# EAGLE design Beagle Cape (EAGLE 6.4)
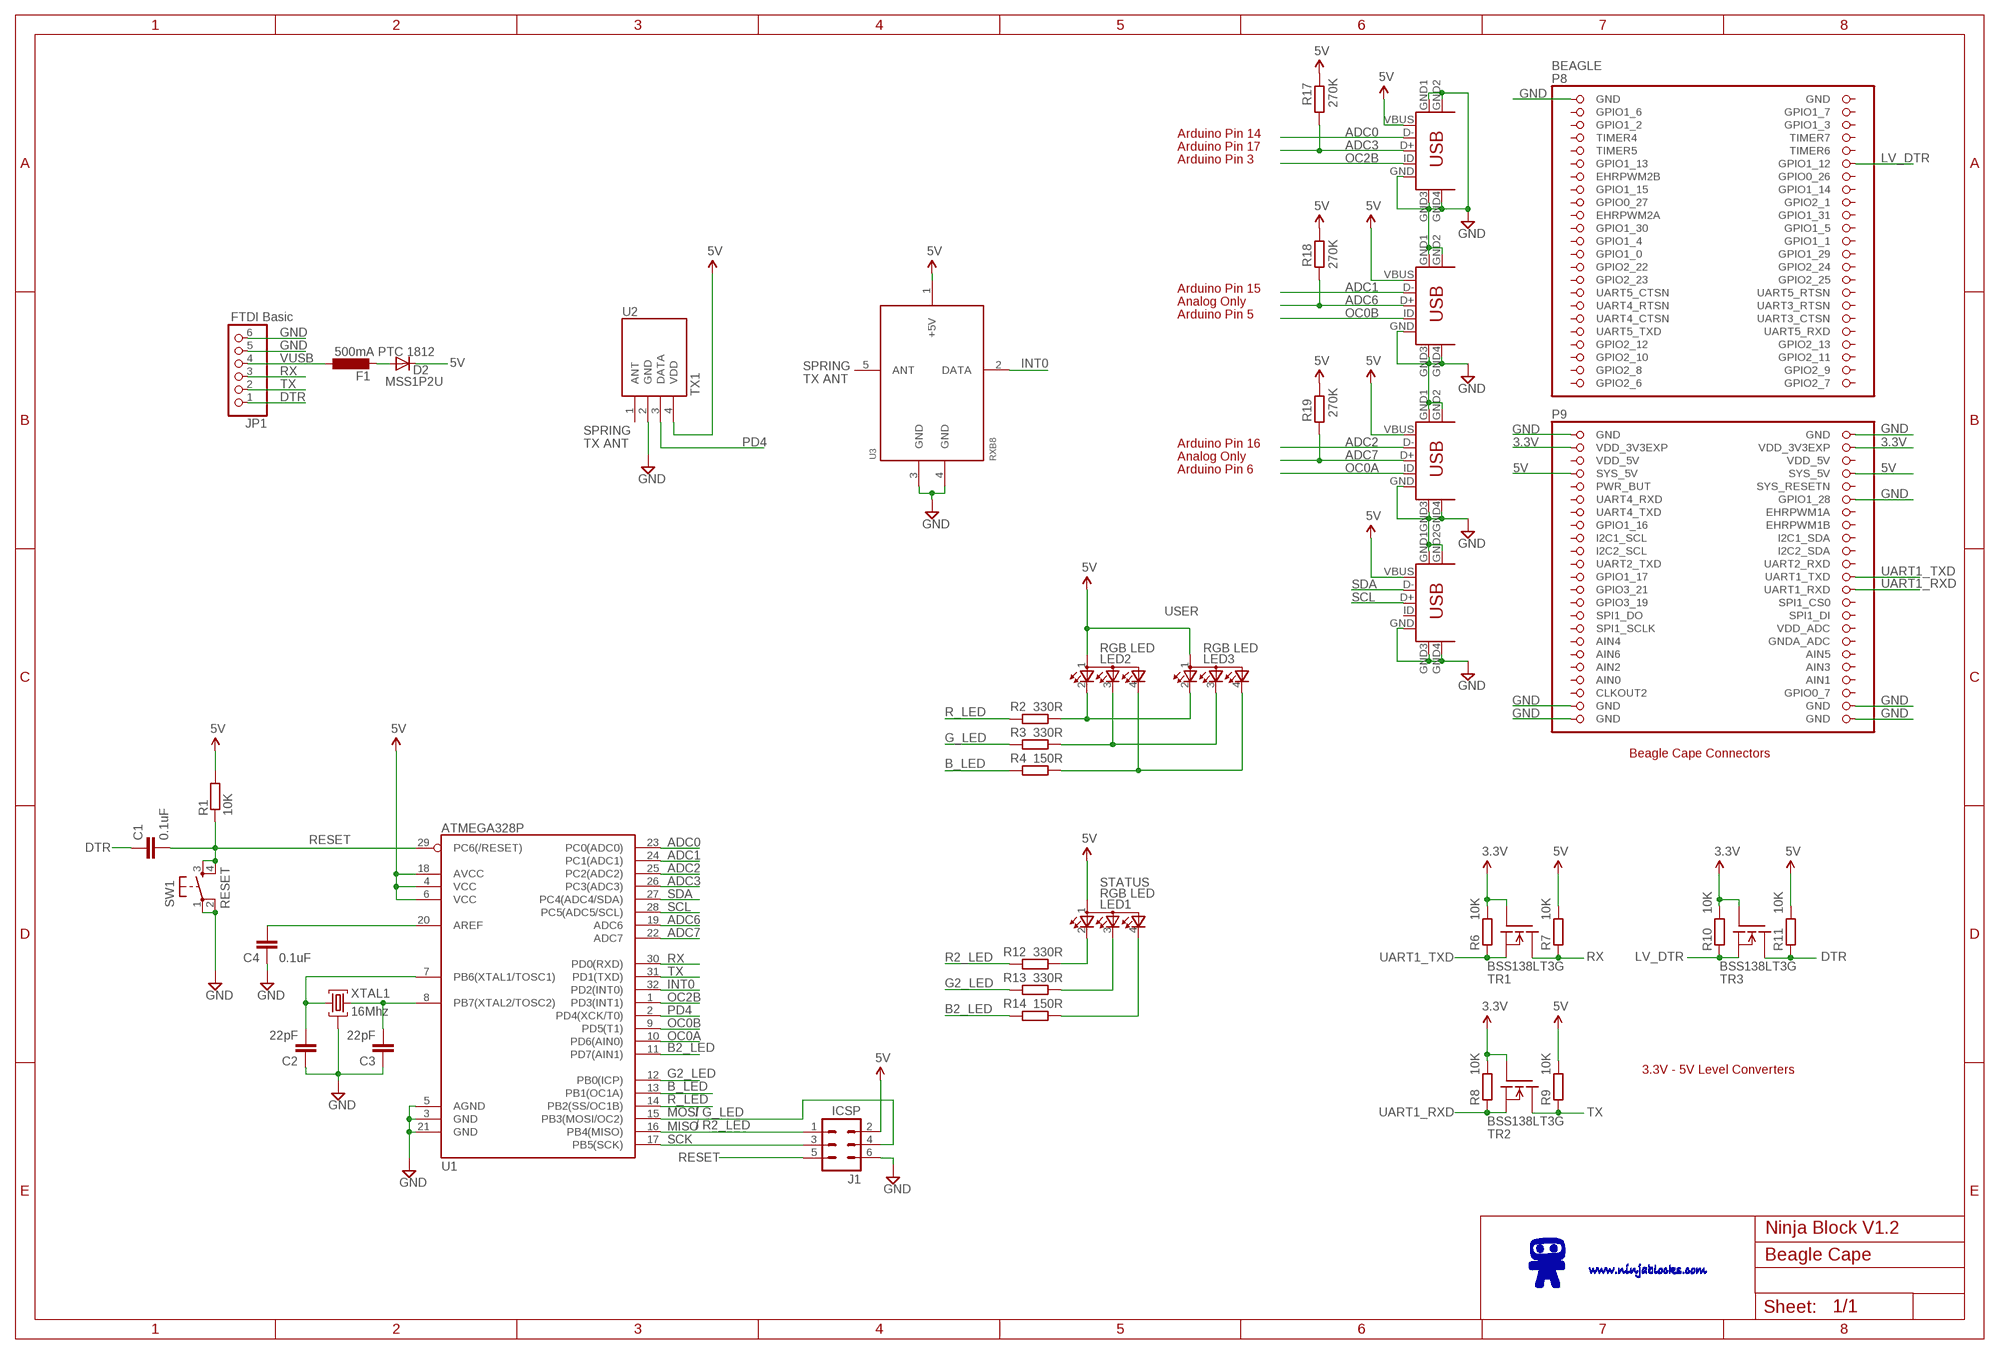
[diagram p0: schematic, sheet 1]

## Parts
BEAGLE  BEAGLEBONE_OUTLINE  [BEAGLEBONE_SHIELD]
C1  0.1uF  C-EUC0603  [C0603]
C2  22pF  C-EUC0603  [C0603]
C3  22pF  C-EUC0603  [C0603]
C4  0.1uF  C-EUC0603  [C0603]
CON1  USB-MINIB  [MOLEX_MINIUSB_B]
CON2  USB-MINIB  [MOLEX_MINIUSB_B]
CON3  USB-MINIB  [MOLEX_MINIUSB_B]
D2  MSS1P2U  [MICROSMP]
F1  500mA PTC 1812  L-EUL1812  [L1812]
I2C  USB-MINIB  [MOLEX_MINIUSB_B]
J1  ICSP  MA03-2  [MA03-2]
JP1  FTDI Basic  PINHD-1X6  [1X06]
LED1  RGB LED  AVAGO_RGB_LED  [AVAGO_LED]
LED2  RGB LED  AVAGO_RGB_LED  [AVAGO_LED]
LED3  RGB LED  AVAGO_RGB_LED  [AVAGO_LED]
R1  10K  R-EU_R0603  [R0603]
R2  330R  R-EU_R0603  [R0603]
R3  330R  R-EU_R0603  [R0603]
R4  150R  R-EU_R0603  [R0603]
R6  10K  R-EU_R0603  [R0603]
R7  10K  R-EU_R0603  [R0603]
R8  10K  R-EU_R0603  [R0603]
R9  10K  R-EU_R0603  [R0603]
R10  10K  R-EU_R0603  [R0603]
R11  10K  R-EU_R0603  [R0603]
R12  330R  R-EU_R0603  [R0603]
R13  330R  R-EU_R0603  [R0603]
R14  150R  R-EU_R0603  [R0603]
R17  270K  R-EU_R0603  [R0603]
R18  270K  R-EU_R0603  [R0603]
R19  270K  R-EU_R0603  [R0603]
SW1  RESET  ALPS_SMD_TAC_SWITCH  [ALPS_SMD_TAC_SWITCH]
TR1  BSS138LT3G  IRLML2502PBF  [SOT23]
TR2  BSS138LT3G  IRLML2502PBF  [SOT23]
TR3  BSS138LT3G  IRLML2502PBF  [SOT23]
U1  ATMEGA328P  ATMEGA168  [TQFP32-08]
U2  TX1  [TX1]
U3  RXB8  [RXB8]
XTAL1  16Mhz  12MHZ  [HC49US-G]

## Nets
3.3V: BEAGLE.49(VDD_3V3EXP) BEAGLE.50(VDD_3V3EXP) R6.1 R8.1 R10.1 TR1.1(G) TR2.1(G) TR3.1(G)
5V: BEAGLE.53(SYS_5V) BEAGLE.54(SYS_5V) CON1.VBUS CON2.VBUS CON3.VBUS D2.C I2C.VBUS J1.2 LED1.1(A1) LED2.1(A1) LED3.1(A1) R1.2 R7.1 R9.1 R11.1 R17.1 R18.1 R19.1 U1.4(VCC) U1.6(VCC) U1.18(AVCC) U2.4(VDD) U3.1(+5V)
ADC0: CON1.D- U1.23(PC0(ADC0))
ADC1: CON2.D- U1.24(PC1(ADC1))
ADC2: CON3.D- U1.25(PC2(ADC2))
ADC3: CON1.D+ R17.2 U1.26(PC3(ADC3))
ADC6: CON2.D+ R18.2 U1.19(ADC6)
ADC7: CON3.D+ R19.2 U1.22(ADC7)
B2_LED: R14.2 U1.11(PD7(AIN1))
B_LED: R4.2 U1.13(PB1(OC1A))
DTR: C1.1 JP1.1 R11.2 TR3.3(D)
G2_LED: R13.2 U1.12(PB0(ICP))
GND: BEAGLE.1(GND) BEAGLE.47(GND) BEAGLE.48(GND) BEAGLE.58(GPIO1_28) BEAGLE.89(GND) BEAGLE.90(GND) BEAGLE.91(GND) BEAGLE.92(GND) C2.1 C3.1 C4.1 CON1.GND CON1.GND1(MTN1) CON1.GND2(MTN2) CON1.GND3(MTN3) CON1.GND4(MTN4) CON2.GND CON2.GND1(MTN1) CON2.GND2(MTN2) CON2.GND3(MTN3) CON2.GND4(MTN4) CON3.GND CON3.GND1(MTN1) CON3.GND2(MTN2) CON3.GND3(MTN3) CON3.GND4(MTN4) I2C.GND I2C.GND1(MTN1) I2C.GND2(MTN2) I2C.GND3(MTN3) I2C.GND4(MTN4) J1.6 JP1.5 JP1.6 SW1.1 SW1.2 U1.3(GND) U1.5(AGND) U1.21(GND) U2.2(GND) U3.3(GND) U3.4(GND) XTAL1.GND
INT0: U1.32(PD2(INT0)) U3.2(DATA)
LV_DTR: BEAGLE.12(GPIO1_12) R10.2 TR3.2(S)
MISO: J1.1 R12.2 U1.16(PB4(MISO))
MOSI: J1.4 R3.2 U1.15(PB3(MOSI/OC2))
N$1: C2.2 U1.7(PB6(XTAL1/TOSC1)) XTAL1.1
N$2: LED2.2(R2) LED3.2(R2) R2.1
N$3: C3.2 U1.8(PB7(XTAL2/TOSC2)) XTAL1.2
N$4: C4.2 U1.20(AREF)
N$5: LED2.3(G3) LED3.3(G3) R3.1
N$6: LED2.4(B4) LED3.4(B4) R4.1
N$9: LED1.2(R2) R12.1
N$10: LED1.3(G3) R13.1
N$11: LED1.4(B4) R14.1
N$16: D2.A F1.2
OC0A: CON3.ID U1.10(PD6(AIN0))
OC0B: CON2.ID U1.9(PD5(T1))
OC2B: CON1.ID U1.1(PD3(INT1))
PD4: U1.2(PD4(XCK/T0)) U2.3(DATA)
R_LED: R2.2 U1.14(PB2(SS/OC1B))
RESET: C1.2 J1.5 R1.1 SW1.3 SW1.4 U1.29(PC6(/RESET))
RX: JP1.3 R7.2 TR1.3(D) U1.30(PD0(RXD))
SCK: J1.3 U1.17(PB5(SCK))
SCL: I2C.D+ U1.28(PC5(ADC5/SCL))
SDA: I2C.D- U1.27(PC4(ADC4/SDA))
TX: JP1.2 R9.2 TR2.3(D) U1.31(PD1(TXD))
UART1_RXD: BEAGLE.72(UART1_RXD) R8.2 TR2.2(S)
UART1_TXD: BEAGLE.70(UART1_TXD) R6.2 TR1.2(S)
VUSB: F1.1 JP1.4
Unconnected: BEAGLE.5(GPIO1_2) BEAGLE.6(GPIO1_3) BEAGLE.7(TIMER4) BEAGLE.8(TIMER7) BEAGLE.9(TIMER5) BEAGLE.10(TIMER6) BEAGLE.11(GPIO1_13) BEAGLE.13(EHRPWM2B) BEAGLE.14(GPIO0_26) BEAGLE.15(GPIO1_15) BEAGLE.16(GPIO1_14) BEAGLE.17(GPIO0_27) BEAGLE.18(GPIO2_1) BEAGLE.19(EHRPWM2A) BEAGLE.20(GPIO1_31) BEAGLE.21(GPIO1_30) BEAGLE.22(GPIO1_5) BEAGLE.23(GPIO1_4) BEAGLE.24(GPIO1_1) BEAGLE.25(GPIO1_0) BEAGLE.26(GPIO1_29) BEAGLE.27(GPIO2_22) BEAGLE.28(GPIO2_24) BEAGLE.29(GPIO2_23) BEAGLE.30(GPIO2_25) BEAGLE.31(UART5_CTSN) BEAGLE.32(UART5_RTSN) BEAGLE.33(UART4_RTSN) BEAGLE.34(UART3_RTSN) BEAGLE.35(UART4_CTSN) BEAGLE.36(UART3_CTSN) BEAGLE.37(UART5_TXD) BEAGLE.38(UART5_RXD) BEAGLE.39(GPIO2_12) BEAGLE.40(GPIO2_13) BEAGLE.41(GPIO2_10) BEAGLE.55(PWR_BUT) BEAGLE.56(SYS_RESETN) BEAGLE.57(UART4_RXD) BEAGLE.59(UART4_TXD) BEAGLE.60(EHRPWM1A) BEAGLE.61(GPIO1_16) BEAGLE.62(EHRPWM1B) BEAGLE.63(I2C1_SCL) BEAGLE.64(I2C1_SDA) BEAGLE.65(I2C2_SCL) BEAGLE.66(I2C2_SDA) BEAGLE.67(UART2_TXD) BEAGLE.68(UART2_RXD) BEAGLE.69(GPIO1_17) BEAGLE.71(GPIO3_21) BEAGLE.73(GPIO3_19) BEAGLE.74(SPI1_CS0) BEAGLE.75(SPI1_DO) BEAGLE.76(SPI1_DI) BEAGLE.77(SPI1_SCLK) BEAGLE.78(VDD_ADC) BEAGLE.79(AIN4) BEAGLE.80(GNDA_ADC) BEAGLE.81(AIN6) BEAGLE.82(AIN5) BEAGLE.83(AIN2) BEAGLE.86(AIN1) BEAGLE.87(CLKOUT2) BEAGLE.88(GPIO0_7) I2C.ID U2.1(ANT) U3.5(ANT)

## Notes on the sheet
- Arduino Pin 14
- Arduino Pin 17
- Arduino Pin 3
- Arduino Pin 15
- Analog Only
- Arduino Pin 5
- SPRING
- TX ANT
- SPRING
- TX ANT | Arduino Pin 16
- Analog Only
- Arduino Pin 6
- USER
- G_LED
- Beagle Cape Connectors
- STATUS
- R2_LED
- 3.3V - 5V Level Converters
- / G_LED
- / R2_LED
- Ninja Block V1.2

## Power pins joined to a net without a drawn wire
AIN0: BEAGLE.85(AIN0)
AIN3: BEAGLE.84(AIN3)
GND: BEAGLE.2(GND)
GPIO1_6: BEAGLE.3(GPIO1_6)
GPIO1_7: BEAGLE.4(GPIO1_7)
GPIO2_6: BEAGLE.45(GPIO2_6)
GPIO2_7: BEAGLE.46(GPIO2_7)
GPIO2_8: BEAGLE.43(GPIO2_8)
GPIO2_9: BEAGLE.44(GPIO2_9)
GPIO2_11: BEAGLE.42(GPIO2_11)
VDD_5V: BEAGLE.51(VDD_5V) BEAGLE.52(VDD_5V)

## Library data of the parts
BEAGLE = adafruit:BEAGLEBONE_OUTLINE: Should match A3 pinout - but not completely tested
C1-C4 = rcl:C-EU: CAPACITOR, European symbol
CON1-CON3 I2C = SparkFun:USB-MINIB: Mini-USB "B" connector with 5th pin broken out. Created new symbol breaking out 5th "ID" pin in mini/micro USB connector spec. See: http://en.wikipedia.org/wiki/Mini_usb#Cables. Uses same footprint as 4-pin symbol. Also added pins to connect to mounting / shield pads if required (probably not generally needed as signals aren't shielded once they leave the connector).
D2 = Monkey:MSS1P2U: MSS1P2U-M3/89A Schottky Rectifier Datasheet : http://www.vishay.com/docs/89020/mss1p3l.pdf
F1 = rcl:L-EU: INDUCTOR, European symbol
J1 = con-lstb:MA03-2: PIN HEADER; OC_FARNELL: unknown; OC_NEWARK: unknown
JP1 = pinhead:PINHD-1X6: PIN HEADER
LED1-LED3 = Monkey:AVAGO_RGB_LED
R1-R4 R6-R14 R17-R19 = resistor:R-EU_: RESISTOR, European symbol
SW1 = Monkey:ALPS_SMD_TAC_SWITCH: ALPS SMD Tactile Switch SKQGAKE010 Source : http://www.farnell.com/datasheets/78970.pdf
TR1-TR3 = Monkey:IRLML2502PBF: IRLML2502 N-Channel HexFet Power Mosfet Datasheet : http://www.irf.com/product-info/datasheets/data/irlml2502pbf.pdf
U1 = SparkFun:ATMEGA168
U2 = ninja:TX1
U3 = ninja:RXB8: RY-RXB8 ASK Receiving module http://www.relyrf.com/rf/ask_receiver/RY-RXB8.htm
XTAL1 = Monkey:12MHZ: HC/49US (AT49) 3RD LEAD CASE-GROUNDED SMD LOW PROFILE CRYSTAL CRYSTAL, 12MHz, 18pF, HC-49/US Source : http://www.abracon.com/Resonators/ABLSG.pdf

## Board
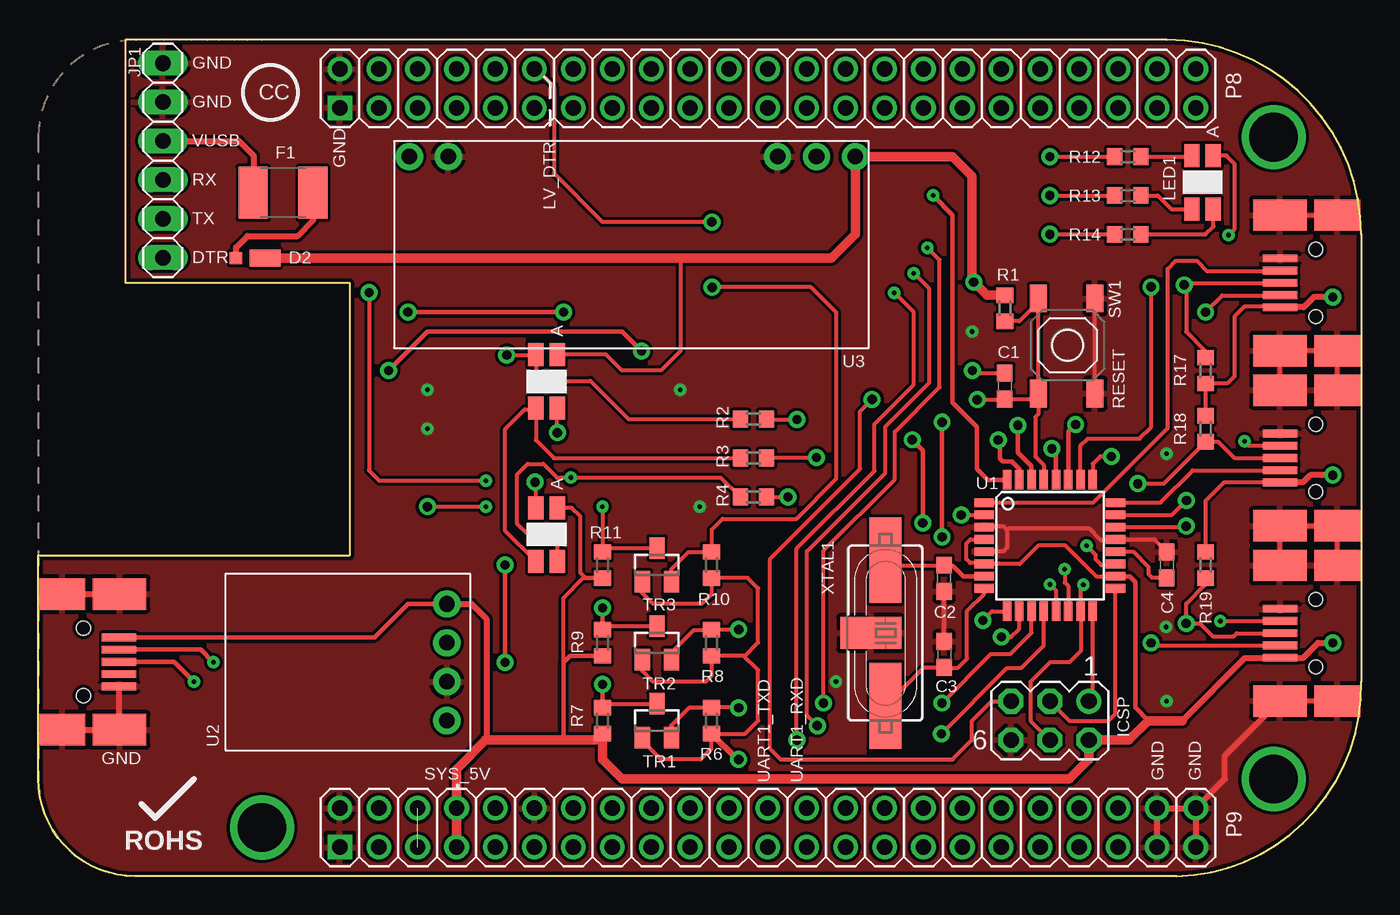
[diagram p1: board, top side]
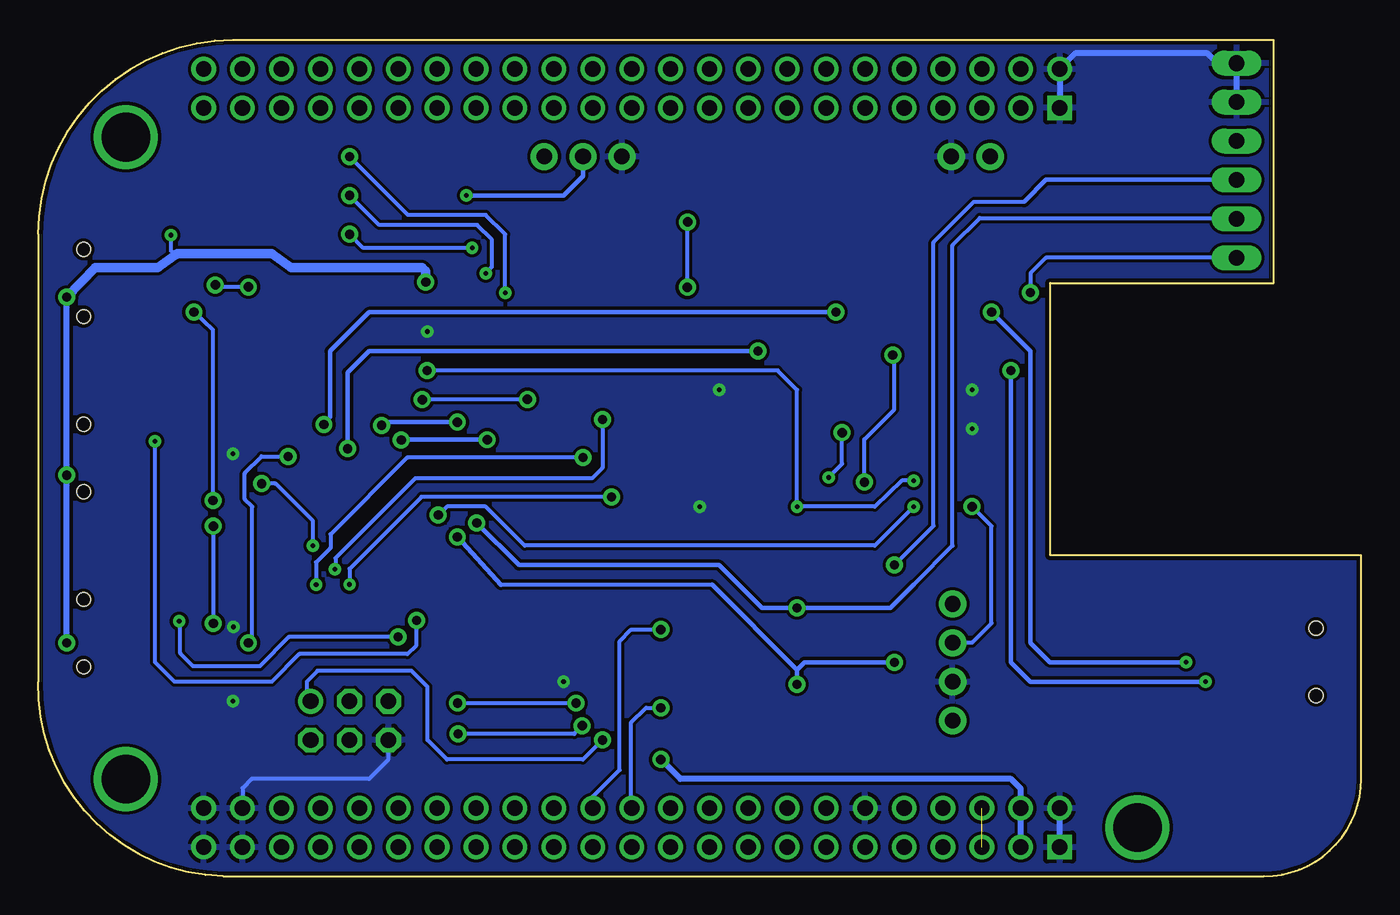
[diagram p2: board, bottom side, seen from below]

Size 86.36 x 54.61 mm. Coordinates in mm from the lower left corner, seen from the top.
Copper layers (1*16): Top 0.035mm / dielectric 1.5mm / Bottom 0.035mm
Design rules "SparkFun": minimum track width 8mil, minimum drill 20mil, track to track 8mil, track to pad 8mil, pad to pad 8mil, via to via 8mil, smd to smd 8mil, copper to edge 10mil, drill to drill 8mil, minimum pad ring 12mil, minimum via ring 10mil, stop-mask expansion 4mil, vias tented up to drill 25mil, thermal gap 10mil

### Footprints (pad centres in the part's own frame; a part is rotated, then mirrored left to right if it is on the bottom)
BEAGLEBONE_SHIELD = drill 1 square: 1 19.685,50.165; 47 19.685,1.905 | drill 1: 2 19.685,52.705; 3 22.225,50.165; 4 22.225,52.705; 5 24.765,50.165; 6 24.765,52.705; 7 27.305,50.165; 8 27.305,52.705; 9 29.845,50.165; 10 29.845,52.705; 11 32.385,50.165; 12 32.385,52.705; 13 34.925,50.165; 14 34.925,52.705; 15 37.465,50.165; 16 37.465,52.705; 17 40.005,50.165; 18 40.005,52.705; 19 42.545,50.165; 20 42.545,52.705; 21 45.085,50.165; 22 45.085,52.705; 23 47.625,50.165; 24 47.625,52.705; 25 50.165,50.165; 26 50.165,52.705; 27 52.705,50.165; 28 52.705,52.705; 29 55.245,50.165; 30 55.245,52.705; 31 57.785,50.165; 32 57.785,52.705; 33 60.325,50.165; 34 60.325,52.705; 35 62.865,50.165; 36 62.865,52.705; 37 65.405,50.165; 38 65.405,52.705; 39 67.945,50.165; 40 67.945,52.705; 41 70.485,50.165; 42 70.485,52.705; 43 73.025,50.165; 44 73.025,52.705; 45 75.565,50.165; 46 75.565,52.705; 48 19.685,4.445; 49 22.225,1.905; 50 22.225,4.445; 51 24.765,1.905; 52 24.765,4.445; 53 27.305,1.905; 54 27.305,4.445; 55 29.845,1.905; 56 29.845,4.445; 57 32.385,1.905; 58 32.385,4.445; 59 34.925,1.905; 60 34.925,4.445; 61 37.465,1.905; 62 37.465,4.445; 63 40.005,1.905; 64 40.005,4.445; 65 42.545,1.905; 66 42.545,4.445; 67 45.085,1.905; 68 45.085,4.445; 69 47.625,1.905; 70 47.625,4.445; 71 50.165,1.905; 72 50.165,4.445; 73 52.705,1.905; 74 52.705,4.445; 75 55.245,1.905; 76 55.245,4.445; 77 57.785,1.905; 78 57.785,4.445; 79 60.325,1.905; 80 60.325,4.445; 81 62.865,1.905; 82 62.865,4.445; 83 65.405,1.905; 84 65.405,4.445; 85 67.945,1.905; 86 67.945,4.445; 87 70.485,1.905; 88 70.485,4.445; 89 73.025,1.905; 90 73.025,4.445; 91 75.565,1.905; 92 75.565,4.445 | drill 3.175: P$1 14.605,3.175; P$2 80.645,6.35; P$3 80.645,48.26
C0603 = smd 1.1 x 1: 1 -0.85,0; 2 0.85,0
MOLEX_MINIUSB_B = smd 2.25 x 0.5: D+ 2.325,-0.005; D- 2.325,0.795; GND 2.325,-1.605; ID 2.325,-0.805; VBUS 2.325,1.595 | smd 3 x 2.05: GND1 -1.4,-4.43; GND3 -1.4,4.42 | smd 3.5 x 2.05: GND2 2.35,-4.43; GND4 2.35,4.42 | hole 0.9: 0,-2.205; 0,2.195
MICROSMP = smd 0.8 x 0.8: A 1.9,0 | smd 2 x 1.1: C 0,0
L1812 = smd 1.9 x 3.4: 1 -1.95,0; 2 1.95,0
MA03-2 = drill 1.016: 1 -2.54,-1.27 | drill 1.016 octagon: 2 -2.54,1.27; 3 0,-1.27; 4 0,1.27; 5 2.54,-1.27; 6 2.54,1.27
1X06 = drill 1.016 long: 1 -6.35,0; 2 -3.81,0; 3 -1.27,0; 4 1.27,0; 5 3.81,0; 6 6.35,0
AVAGO_LED = smd 1.5 x 1: 1 1.75,-0.7; 2 1.75,0.7; 3 -1.75,0.7; 4 -1.75,-0.7
R0603 = smd 1 x 1.1: 1 -0.85,0; 2 0.85,0
ALPS_SMD_TAC_SWITCH = smd 1.8 x 1.1: 1 0,3.7; 2 6.2,3.7; 3 0,0; 4 6.2,0
SOT23 = smd 1 x 1.4: 1 -0.95,-1.1; 2 0.95,-1.1; 3 0,1.1
TQFP32-08 = smd 1.27 x 0.559: 1 -4.293,2.8; 2 -4.293,2; 3 -4.293,1.2; 4 -4.293,0.4; 5 -4.293,-0.4; 6 -4.293,-1.2; 7 -4.293,-2; 8 -4.293,-2.8; 17 4.293,-2.8; 18 4.293,-2; 19 4.293,-1.2; 20 4.293,-0.4; 21 4.293,0.4; 22 4.293,1.2; 23 4.293,2; 24 4.293,2.8 | smd 0.559 x 1.27: 9 -2.8,-4.293; 10 -2,-4.293; 11 -1.2,-4.293; 12 -0.4,-4.293; 13 0.4,-4.293; 14 1.2,-4.293; 15 2,-4.293; 16 2.8,-4.293; 25 2.8,4.293; 26 2,4.293; 27 1.2,4.293; 28 0.4,4.293; 29 -0.4,4.293; 30 -1.2,4.293; 31 -2,4.293; 32 -2.8,4.293
TX1 = drill 1.016 pad 1.778: 1 0,0; 2 2.54,0; 3 5.08,0; 4 7.62,0
RXB8 = drill 1.016 pad 1.778: 1 -24.13,0; 2 -21.59,0; 3 -19.05,0; 4 2.45,0; 5 4.99,0
HC49US-G = smd 5.6 x 2.1: 1 -11.74,0.95; 2 -2.24,0.95 | smd 2.1 x 4: GND -6.99,0

### Placement (x,y rotation side)
BEAGLE  0,0 0 top
C1  63.09,32 270 top
C2  59.13,19.46 90 top
C3  59.13,14.48 270 top
C4  73.66,20.32 270 top
CON1  83.4,38.73 180 top
CON2  83.4,27.3 180 top
CON3  83.4,15.87 180 top
D2  14.81,40.36 180 top
F1  15.98,44.63 0 top
I2C  2.95,14 0 top
J1  66.04,10.16 180 top
JP1  8.13,46.74 90 top
LED1  76,45.3 90 top
LED2  33.18,32.3 90 top
LED3  33.18,22.3 90 top
R1  63.09,37.08 90 top
R2  46.69,29.84 0 top
R3  46.69,27.3 0 top
R4  46.69,24.77 0 top
R6  43.94,10.16 90 top
R7  36.83,10.16 90 top
R8  43.94,15.24 90 top
R9  36.83,15.24 90 top
R10  43.94,20.32 90 top
R11  36.83,20.32 90 top
R12  71.12,46.99 180 top
R13  71.12,44.45 180 top
R14  71.12,41.91 180 top
R17  76.2,33.02 90 top
R18  76.2,29.21 270 top
R19  76.2,20.32 270 top
SW1  65.28,37.72 270 top
TR1  40.39,10.16 0 top
TR2  40.39,15.24 0 top
TR3  40.39,20.32 0 top
U1  66.04,21.59 0 top
U2  26.67,10.16 90 top
U3  29.21,46.99 180 top
XTAL1  54.36,8.89 270 top

### Tracks (layer width: path | path; a pad name or v marks a point on that pad's centre or on a via)
3.3V  (via drill 0.6)
  Top 0.254: TR3.1 39.44,19.12 39.37,19.05 39.37,18.54 40.13,17.78 43.31,17.78 43.94,18.41 R10.1 43.95,19.48 46.3,19.48 46.99,18.8 46.99,15.27 46.13,14.4 46.05,14.4 | TR2.1 39.44,13.4 40.13,12.7 43.56,12.7 43.94,13.08 43.94,13.89 44.45,14.4 | TR1.1 39.44,8.82 40.64,7.62 43.23,7.62 43.92,8.31 43.92,9.29 R6.1 46.14,9.31 46.99,10.16 46.99,13.46 46.05,14.4 | 46.05,14.4 44.45,14.4 | 44.45,14.4 43.95,14.4 R8.1
  Top 0.406: v45.72,7.62 45.63,7.62 R6.1
  Bottom 0.406: BEAGLE.49 BEAGLE.50 22.23,5.71 22.86,6.35 44.45,6.35 v45.72,7.62
5V  (via drill 0.3, 0.6)
  Top 0.254: U1.4 60.85,21.99 60.58,21.72 60.58,20.7 60.83,20.45 61.69,20.45 U1.6 64.08,20.39 65.28,21.59 67.06,21.59 69.09,19.56 70.3,19.56 U1.18 | CON1.VBUS | CON1.VBUS | v61.06,38.79 60.96,38.89 | R18.1 R17.1 77.61,32.17 78.08,32.64 78.08,36.52 78.74,37.19 81.03,37.19 CON1.VBUS | CON2.VBUS 77.39,25.7 76.2,24.51 R19.1 | LED3.1 34.82,24.05 35.38,23.5 35.38,19.81 35.72,19.47 R11.1 35.57,19.47 34.29,18.19 34.29,13.97 | LED1.1 77.56,47.05 78.11,46.51 78.11,42.27 v77.7,41.86 | LED2.1 37.06,34.05 38.1,33.02 40.64,33.02 41.91,34.29 41.91,40.36
  Top 0.305: U1.18 71.25,19.58 71.6,19.23 71.6,12.09 71.6,11.02 72.47,10.16 | 34.29,8.89 34.29,13.97 34.71,14.39 R9.1 | I2C.VBUS 21.95,15.6 24.13,17.78 U2.4
  Top 0.406: 81.13,25.7 CON2.VBUS 82.56,25.71 83.04,26.19 83.79,26.19 v84.5,26.19 | CON1.VBUS 81.05,37.13 | v84.5,37.82 83.27,37.82 82.6,37.15 CON1.VBUS | v84.5,15.24 83.55,15.24 82.58,14.27 CON3.VBUS 81.05,14.25 78.77,14.25 74.68,10.16 | 36.41,8.89 R7.1 | U2.4 28.27,17.78 29.26,16.79 29.26,8.94 29.21,8.89
  Top 0.61: BEAGLE.53 BEAGLE.54 27.3,6.99 29.21,8.89 34.29,8.89 36.41,8.89 | R1.2 61.91,37.93 v61.06,38.79 | 74.68,10.16 72.47,10.16 71.2,8.89 J1.2 68.58,7.62 67.31,6.35 38.1,6.35 36.83,7.62 R7.1 | 60.96,38.89 60.96,45.72 59.69,46.99 U3.1 53.34,41.91 51.79,40.36 41.91,40.36 D2.C
  Bottom 0.254: v77.7,41.86 77.7,40.84 77.41,40.56
  Bottom 0.406: v84.5,37.82 v84.5,26.19 v84.5,15.24
  Bottom 0.61: v61.06,38.79 61.06,39.5 61.29,39.73 69.85,39.73 71.12,40.64 77.29,40.64 77.41,40.56 78.56,39.73 82.65,39.73 v84.5,37.82
ADC0  (via drill 0.6)
  Top 0.254: U1.23 74.01,23.59 v74.95,24.54 | CON1.D- 81.06,37.92 77.29,37.92 v76.2,36.83
  Bottom 0.254: v74.95,24.54 74.95,35.66 v76.2,36.83
ADC1
  Top 0.254: U1.24 73.26,24.39 75.36,26.49 81.06,26.49 CON2.D-
ADC2  (via drill 0.6)
  Top 0.254: v70.05,27.41 69.32,27.41 68.83,26.92 U1.25 | CON3.D- 72.81,15.07 v72.64,15.24
  Bottom 0.254: v70.05,27.41 71.78,27.41 72.87,26.31 72.87,24.61 72.39,24.13 72.39,15.49 v72.64,15.24
ADC3  (via drill 0.6)
  Top 0.254: v72.64,38.48 72.64,29.34 71.88,28.57 68.5,28.57 68.04,28.11 U1.26 | CON1.D+ 74.94,38.74 v74.8,38.61 74.93,38.48 74.93,35.56 76.2,34.29 R17.2
  Bottom 0.254: v72.64,38.48 74.68,38.48 v74.8,38.61
ADC6  (via drill 0.3, 0.6)
  Top 0.254: R18.2 76.22,28.34 | R18.2 76.17,28.34 | R18.2 76.19,28.37 | U1.19 69.92,20.39 69.85,20.32 69.39,20.32 69.01,20.7 69.01,21.01 v68.43,21.59 | v71.78,25.63 73.47,25.63 R18.2 | CON2.D+ 78.08,27.31 77.01,28.37 76.21,28.37 R18.2
  Bottom 0.254: v68.43,21.59 68.43,23.19 70.87,25.63 v71.78,25.63
ADC7  (via drill 0.6)
  Top 0.254: CON3.D+ 78.23,15.87 78.03,15.67 76.66,15.67 75.82,16.51 v74.93,16.51 74.93,17.78 76.2,19.05 R19.2 | U1.22 74.86,22.79 v74.93,22.86
  Bottom 0.254: v74.93,22.86 v74.93,16.51
B2_LED  (via drill 0.3, 0.6)
  Top 0.254: U1.11 64.84,15.89 63.45,14.5 62.18,14.5 v58.98,11.3 | v51.26,11.3 51.26,21.26 55.91,25.91 55.91,29.01 58.83,31.93 58.83,40.23 v58.04,41.02 | v66.04,41.91 R14.2
  Bottom 0.254: v51.26,11.3 v58.98,11.3 | v58.04,41.02 65.15,41.02 v66.04,41.91
B_LED  (via drill 0.3, 0.6)
  Top 0.254: U1.13 66.44,18.65 v66.04,19.05 | R4.2 v48.95,24.77
  Bottom 0.254: v48.95,24.77 61.34,24.77 66.04,20.07 v66.04,19.05
DTR  (via drill 0.3, 0.6)
  Top 0.254: TR3.3 37.08,21.42 R11.2 v36.83,24.13 | v21.59,38.1 21.59,26.49 22.25,25.83 v29.21,25.83 | C1.1 61.15,32.85 v60.98,33.02
  Bottom 0.254: JP1.1 20.57,40.39 21.59,39.37 v21.59,38.1 | v29.21,25.83 30,25.83 31.75,24.13 v36.83,24.13 36.83,31.75 38.1,33.02 v60.98,33.02
G2_LED  (via drill 0.3, 0.6)
  Top 0.254: U1.12 65.64,15.07 64.16,13.59 63.25,13.59 v58.95,9.3 | v57.15,39.37 58.17,38.35 58.17,32.23 55.3,29.36 55.3,26.34 50.16,21.21 50.16,10.52 v50.85,9.83 | v66.04,44.45 R13.2
  Bottom 0.254: v57.15,39.37 57.15,39.4 56.74,39.8 56.74,41.55 57.71,42.52 64.11,42.52 v66.04,44.45 | v58.95,9.3 51.38,9.3 v50.85,9.83
GND  (via drill 0.3)
  Top 0.254: SW1.2 SW1.1 | U1.3 62.16,22.79 62.23,22.86 62.99,22.86 63.25,22.61 | 63.25,22.61 63.25,21.46 62.99,21.21 61.77,21.21 U1.5 | 63.25,22.61 63.37,22.73 68.58,22.73 69.34,21.97 70.31,21.97 U1.21 72.84,21.99 C4.1 | CON1.GND2 CON1.GND1
  Top 0.305: CON3.GND2 CON2.GND4 CON2.GND3 CON3.GND1 | CON3.GND4 CON3.GND3 | CON2.GND1 CON1.GND3 CON1.GND4 CON2.GND2 | C3.1 C2.1
  Top 0.406: BEAGLE.89 BEAGLE.90 BEAGLE.92 | BEAGLE.92 BEAGLE.91 | I2C.GND1 I2C.GND2 5.28,9.57 I2C.GND 5.25,12.38 | I2C.GND3 I2C.GND4 | BEAGLE.92 77.47,6.35 77.47,7.87 CON3.GND4
  Bottom 0.254: J1.6 63.5,7.62 64.77,6.35 72.42,6.35 73.03,5.74 BEAGLE.90
  Bottom 0.406: BEAGLE.47 BEAGLE.48 | BEAGLE.1 BEAGLE.2 18.67,53.72 10.03,53.72 9.4,53.09 JP1.6 JP1.5
  other vias: 73.63,16.28 60.96,35.56 73.66,27.58 73.66,11.43 25.4,29.21 25.4,31.75 52.07,12.7 41.91,31.75 43.18,24.13
  pour Top: -5.08,58.42 -5.08,-5.08 88.9,-5.08 88.9,-3.81 88.9,58.42
  pour Bottom: -5.08,58.42 88.9,58.42 88.9,-5.08 -5.08,-5.08 -5.08,-2.54
INT0  (via drill 0.3)
  Top 0.305: U1.32 61.98,25.88 61.27,26.59 61.27,29.34 59.69,30.94 59.69,43.18 v58.42,44.45
  Bottom 0.305: v58.42,44.45 52.07,44.45 50.8,45.72 U3.2
LV_DTR  (via drill 0.6)
  Top 0.254: TR3.2 41.34,20.05 42.44,21.16 43.93,21.16 R10.2 43.97,21.2 43.97,22.63 44.68,23.34 49.48,23.34 52.09,25.96 52.09,36.8 50.44,38.46 v43.99,38.46 | v43.97,42.72 36.83,42.72 33.66,45.9 33.66,51.56 32.51,52.7 BEAGLE.12
  Bottom 0.254: v43.97,42.72 43.97,38.48 v43.99,38.46
MISO  (via drill 0.3, 0.6)
  Top 0.254: U1.16 68.84,11.69 J1.1 | v66.04,46.99 R12.2 | v55.88,38.1 57.15,36.83 57.15,32.11 54.59,29.54 54.59,26.47 49.51,21.39 49.51,8.91 v49.53,8.89
  Bottom 0.254: v66.04,46.99 62.23,43.18 57.15,43.18 55.88,41.91 v55.88,38.1 | v49.53,8.89 50.8,7.62 59.69,7.62 60.96,8.89 60.96,12.37 62,13.41 68.13,13.41 68.84,12.7 68.84,11.69 J1.1
MOSI  (via drill 0.3, 0.6)
  Top 0.254: v50.8,27.33 48.07,27.33 R3.2 | v68.22,19.02 68.04,18.84 U1.15 68.05,14.71 67.31,13.97 66.04,13.97 64.77,12.7 64.77,10.16 J1.4
  Bottom 0.254: v50.8,27.33 62.28,27.33 67.28,22.33 67.28,21.44 68.22,20.5 v68.22,19.02
N$1
  Top 0.254: 55.63,20.31 C2.2
  Top 0.305: 55.63,20.31 XTAL1.1 | U1.7 60.4,19.59 59.72,20.27 59.17,20.27 C2.2
  Top 0.406: 54.77,21.17 XTAL1.1 55.37,20.56 55.37,19.56 55.4,19.59
N$2  (via drill 0.6)
  Top 0.254: LED3.2 32.48,25.69 v32.44,25.73 | v30.58,34.04 32.46,34.04 LED2.2 32.48,32.77 32.92,32.33 36.04,32.33 38.53,29.84 R2.1
  Bottom 0.254: v32.44,25.73 32.44,28.52 30.48,30.48 30.48,33.93 v30.58,34.04
N$3
  Top 0.254: U1.8 61.75,18.44 60.63,17.32 60.63,14.2 60.05,13.61 59.15,13.61 C3.2 57.8,13.63 XTAL1.2
  Top 0.406: 54.76,10.58 XTAL1.2 55.61,11.43
N$4
  Top 0.254: U1.20 71.47,21.19 72.47,20.19 72.47,19.74 72.69,19.51 73.62,19.51 C4.2
N$5
  Top 0.254: R3.1 33.66,27.3 32.48,28.48 LED2.3 32.41,30.48 31.75,30.48 30.48,29.21 30.48,22.55 LED3.3
N$6  (via drill 0.3, 0.6)
  Top 0.254: LED3.4 33.88,21.85 33.45,22.28 32,22.28 31.27,23.01 31.27,26.24 31.95,26.92 32.97,26.92 33.86,26.04 v34.77,26.04 44.54,26.04 R4.1 | LED2.4 v33.88,28.96
  Bottom 0.254: v33.88,28.96 33.88,26.92 v34.77,26.04
N$9
  Top 0.254: R12.1 75.23,46.99 LED1.2
N$10
  Top 0.254: R13.1 73.08,44.45 73.97,43.56 LED1.3
N$11
  Top 0.254: R14.1 76.2,41.91 76.71,42.42 LED1.4
N$16
  Top 0.406: D2.A 12.91,41.05 13.66,41.81 16.92,41.81 17.96,42.85 17.96,44.6 F1.2
OC0A  (via drill 0.3, 0.6)
  Top 0.254: v77.17,16.66 81.07,16.66 CON3.ID | U1.10 64.04,16.16 63.5,15.62 v62.87,15.62
  Bottom 0.254: v77.17,16.66 77.09,16.59 77.09,14.55 76.25,13.72 71.91,13.72 70,15.62 v62.87,15.62
OC0B  (via drill 0.3, 0.6)
  Top 0.254: U1.9 62.26,17.3 v61.67,16.71 | CON2.ID 81.07,28.12 79.02,28.12 v78.74,28.4
  Bottom 0.254: v61.67,16.71 61.67,15.09 62.26,14.5 69.32,14.5 71.12,12.7 77.47,12.7 78.74,13.97 v78.74,28.4
OC2B
  Top 0.254: CON1.ID 81.06,39.52 76.28,39.52 75.62,40.18 74.27,40.18 73.74,39.65 73.74,29.26 68.83,24.38 68.83,24.39 U1.1
PD4  (via drill 0.3, 0.6)
  Top 0.254: U1.2 v60.26,23.59 v60.25,23.6 | v25.4,24.13 v29.21,24.13
  Bottom 0.254: v60.25,23.6 60.22,23.6 59.69,24.13 57.15,24.13 54.61,21.59 31.75,21.59 v29.21,24.13 | v25.4,24.13 24.13,22.86 24.13,16.51 25.4,15.24 U2.3
R_LED  (via drill 0.3, 0.6)
  Top 0.254: v49.53,29.82 48.07,29.82 R2.2 | U1.14 67.24,18.94 67,19.18 v67,20.04
  Bottom 0.254: v49.53,29.82 49.53,26.67 50.22,25.98 61.75,25.98 66.95,20.78 66.95,20.09 v67,20.04
RESET  (via drill 0.6)
  Top 0.254: SW1.4 SW1.3 | 65.27,31.15 SW1.4 | SW1.3 65.66,37.74 | SW1.3 65.28,37.49 64.03,36.25 63.1,36.25 R1.1 | 65.27,31.15 65.64,30.78 | 65.27,31.15 C1.2 63.05,31.11 v61.29,31.11 | U1.29 65.64,26.84 65.08,27.41 65.08,29.97 65.28,30.18 SW1.4 | J1.5 62.23,11.43 60.96,10.16 60.96,8.89 59.69,7.62 48.46,7.62 47.78,8.31 47.78,20.73 53.65,26.59 53.65,30.35 v54.43,31.14
  Bottom 0.254: v54.43,31.14 61.27,31.14 v61.29,31.11
RX  (via drill 0.6)
  Top 0.254: TR1.3 37.08,11.26 R7.2 | U1.30
  Top 0.305: v59,22.15 v59,29.64 | v30.48,13.97 v30.48,20.32 | v36.83,12.52 R7.2 | U1.30 64.84,26.78 63.96,27.66 v63.96,29.44
  Bottom 0.254: 22,44.04 25.27,44.04 27.91,41.4 27.91,22.89 v30.48,20.32
  Bottom 0.305: v59,22.15 56.16,19.02 42.39,19.05 36.83,13.49 | JP1.3 20.57,45.47 22,44.04 | v30.48,13.97 36.35,13.97 36.83,13.49 | 36.83,13.49 v36.83,12.52 | v59,29.64 63.75,29.64 v63.96,29.44
SCK
  Top 0.254: U1.17 70.31,18.77 70.31,10.62 69.85,10.16 67.31,10.16 J1.3
SCL  (via drill 0.3, 0.6)
  Top 0.305: U1.28 66.44,27.54 v66.17,27.91 | I2C.D+ 8.87,13.99 v10.16,12.7 | v22.86,33.02 25.4,35.56 38.1,35.56 v39.37,34.29
  Bottom 0.305: v66.17,27.91 66.17,32.89 64.77,34.29 v39.37,34.29 | v22.86,33.02 22.86,13.97 21.59,12.7 v10.16,12.7
SDA  (via drill 0.3, 0.6)
  Top 0.254: 67.26,25.9 U1.27
  Top 0.305: I2C.D- 10.61,14.79 v11.43,13.97 | v24.13,36.83 v34.29,36.83 | 67.26,25.9 67.26,29.03 v67.72,29.49
  Bottom 0.305: v11.43,13.97 20.32,13.97 21.59,15.24 21.59,34.29 v24.13,36.83 | v34.29,36.83 64.77,36.83 67.31,34.29 67.31,29.97 v67.72,29.49
TX  (via drill 0.6)
  Top 0.254: TR2.3 37.08,16.34 R9.2 | U1.31 | v62.66,28.47 62.76,28.45
  Top 0.305: v36.83,17.53 R9.2 | v57.73,23.06 57.73,27.81 v57.05,28.5 | U1.31 64.03,26.59 63.55,27.08 62.97,27.08 62.76,27.28 62.76,28.45
  Bottom 0.254: 8.15,42.95 JP1.2 8.18,42.98 24.89,42.98 26.67,41.2 26.67,21.59 29.21,19.05 | 62.71,28.5 v62.66,28.47
  Bottom 0.305: v57.73,23.06 54.99,20.32 41.91,20.32 39.12,17.53 v36.83,17.53 30.73,17.53 29.21,19.05 | v57.05,28.5 62.71,28.5
UART1_RXD  (via drill 0.6)
  Top 0.254: TR2.2 41.4,14.21 41.4,14.68 42.77,16.05 43.91,16.05 R8.2 45.71,16.09 v45.72,16.1
  Bottom 0.254: BEAGLE.72 50.16,5.18 48.41,6.93 48.41,15.34 47.65,16.1 v45.72,16.1
UART1_TXD  (via drill 0.6)
  Top 0.254: v45.72,11 45.71,11.01 R6.2 43.93,11 42.49,11 41.34,9.84 TR1.2
  Bottom 0.254: v45.72,11 46.69,11 47.65,10.03 47.65,4.47 BEAGLE.70
VDD_5V  (1 unrouted)
VUSB
  Top 0.406: JP1.4 13.11,48.01 14.07,47.04 14.07,44.67 F1.1

### Text on the board
tPlace: GND | CC | P8 | GND | VUSB | LV_DTR | GND | RX | TX | DTR | ICSP | GND | SYS_5V | UART1_TXD | UART1_RXD | GND | GND | P9 | ROHS